# Altium schematic sheet LCD_Module.SchDoc
size A3
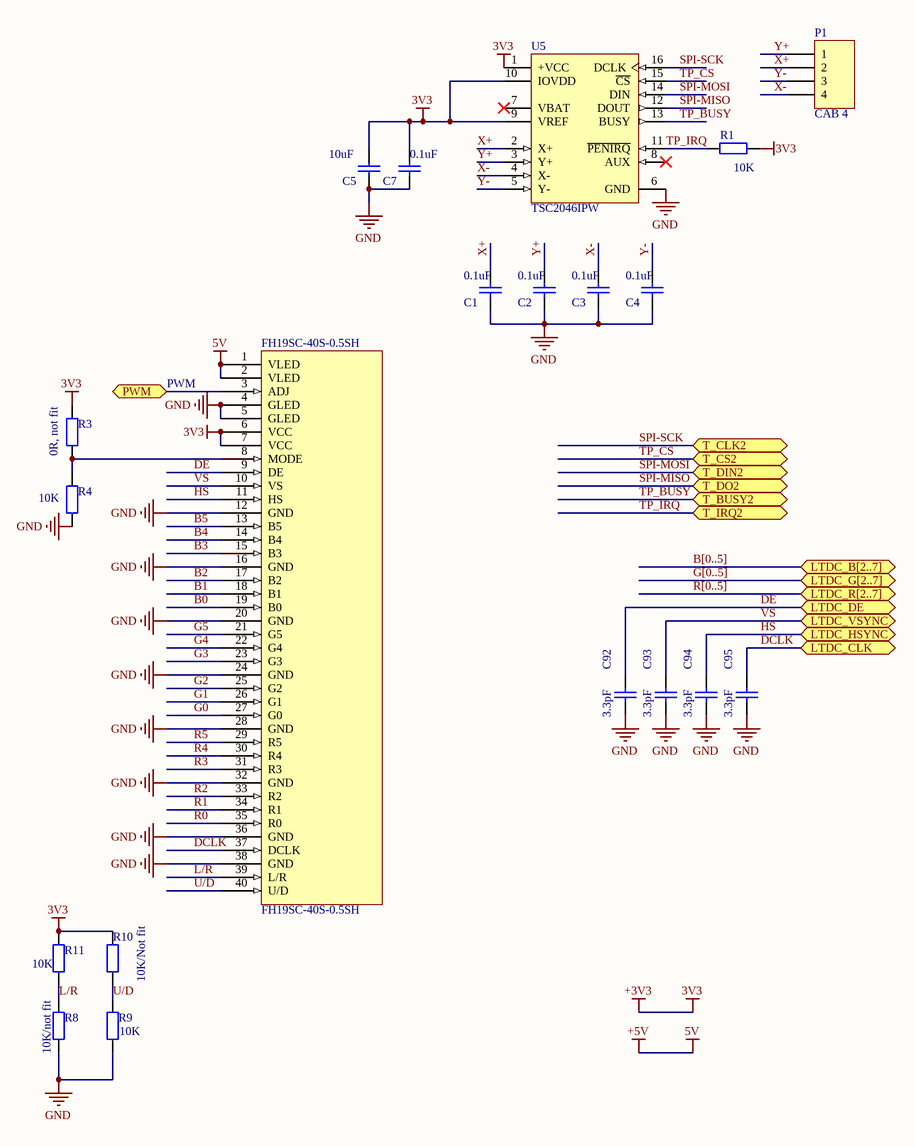
[diagram p0: LCD_Module.SchDoc]

## Parts
C1  0.1uF  [0603_C]
C2  0.1uF  [0603_C]
C3  0.1uF  [0603_C]
C4  0.1uF  [0603_C]
C5  10uF  [0603_C]
C7  0.1uF  [0603_C]
C92  3.3pF  [0603_C]
C93  3.3pF  [0603_C]
C94  3.3pF  [0603_C]
C95  3.3pF  [0603_C]
FH19SC-40S-0.5SH  FH19SC-40S-0.5SH  [FFC/SM0.5-2H40A]
P1  CAB 4  [FFC/SM1.0-2H4]
R1  10K  [0603_R]
R3  0R, not fit  [0603_R]
R4  10K  [0603_R]
R8  10K/not fit  [0603_R]
R9  10K  [0603_R]
R10  10K/Not fit  [0603_R]
R11  10K  [0603_R]
U5  TSC2046IPW  [PW016]

## Ports
LTDC_B[2..7], LTDC_CLK, LTDC_DE, LTDC_G[2..7], LTDC_HSYNC, LTDC_R[2..7], LTDC_VSYNC, PWM, T_BUSY2, T_CLK2, T_CS2, T_DIN2, T_DO2, T_IRQ2

## Nets
+3V3: C5.1 C7.1 FH19SC-40S-0.5SH.6(VCC) FH19SC-40S-0.5SH.7(VCC) R1.1 R3.2 R10.1 R11.1 U5.1(+VCC) U5.9(VREF) U5.10(IOVDD)  [also labelled 3V3]
+5V: FH19SC-40S-0.5SH.1(VLED) FH19SC-40S-0.5SH.2(VLED)  [also labelled 5V]
GND: C1.2 C2.2 C3.2 C4.2 C5.2 C7.2 C92.2 C93.2 C94.2 C95.2 FH19SC-40S-0.5SH.4(GLED) FH19SC-40S-0.5SH.5(GLED) FH19SC-40S-0.5SH.12(GND) FH19SC-40S-0.5SH.16(GND) FH19SC-40S-0.5SH.20(GND) FH19SC-40S-0.5SH.24(GND) FH19SC-40S-0.5SH.28(GND) FH19SC-40S-0.5SH.32(GND) FH19SC-40S-0.5SH.36(GND) FH19SC-40S-0.5SH.38(GND) R4.1 R8.2 R9.2 U5.6(GND)
B0: FH19SC-40S-0.5SH.19(B0)
B1: FH19SC-40S-0.5SH.18(B1)
B2: FH19SC-40S-0.5SH.17(B2)
B3: FH19SC-40S-0.5SH.15(B3)
B4: FH19SC-40S-0.5SH.14(B4)
B5: FH19SC-40S-0.5SH.13(B5)
DCLK: C95.1 FH19SC-40S-0.5SH.37(DCLK) ; port LTDC_CLK
DE: C92.1 FH19SC-40S-0.5SH.9(DE) ; port LTDC_DE
G0: FH19SC-40S-0.5SH.27(G0)
G1: FH19SC-40S-0.5SH.26(G1)
G2: FH19SC-40S-0.5SH.25(G2)
G3: FH19SC-40S-0.5SH.23(G3)
G4: FH19SC-40S-0.5SH.22(G4)
G5: FH19SC-40S-0.5SH.21(G5)
HS: C94.1 FH19SC-40S-0.5SH.11(HS) ; port LTDC_HSYNC
L/R: FH19SC-40S-0.5SH.39(L/R) R8.1 R11.2
PWM: FH19SC-40S-0.5SH.3(ADJ) ; port PWM
R0: FH19SC-40S-0.5SH.35(R0)
R1: FH19SC-40S-0.5SH.34(R1)
R2: FH19SC-40S-0.5SH.33(R2)
R3: FH19SC-40S-0.5SH.31(R3)
R4: FH19SC-40S-0.5SH.30(R4)
R5: FH19SC-40S-0.5SH.29(R5)
SPI-MISO: U5.12(DOUT) ; port T_DO2
SPI-MOSI: U5.14(DIN) ; port T_DIN2
SPI-SCK: U5.16(DCLK) ; port T_CLK2
TP_BUSY: U5.13(BUSY) ; port T_BUSY2
TP_CS: U5.15(~{CS}) ; port T_CS2
TP_IRQ: R1.2 U5.11(~{PENIRQ}) ; port T_IRQ2
U/D: FH19SC-40S-0.5SH.40(U/D) R9.1 R10.2
VS: C93.1 FH19SC-40S-0.5SH.10(VS) ; port LTDC_VSYNC
X+: C1.1 P1.2 U5.2(X+)
X-: C3.1 P1.4 U5.4(X-)
Y+: C2.1 P1.1 U5.3(Y+)
Y-: C4.1 P1.3 U5.5(Y-)
NetFH19SC-40S-0.5SH_8: FH19SC-40S-0.5SH.8(MODE) R3.1 R4.2

Not connected (* = marked no-connect by the designer): U5 7(VBAT)* 8(AUX)*

## Buses and harness runs
bus B[0..5] = port LTDC_B[2..7]
bus G[0..5] = port LTDC_G[2..7]
bus R[0..5] = port LTDC_R[2..7]

## Notes on the sheet
- PWM

## Library data of the parts
C1-C5 C7 = GRM188R71A225KE15: Murata General Purpose Ceramic Cap 0603 2.2uF 10V 10% X7R; Supplier 1: Digi-Key; Supplier Part Number 1: 490-4520-1-ND
  C1-C4 C7: Value: 0.1uF
  C5: Value: 10uF
C92-C95 = GRM188R71A225KE15: Murata General Purpose Ceramic Cap 0603 2.2uF 10V 10% X7R; Value: 10nF; Supplier 1: Digi-Key; Supplier Part Number 1: 490-4520-1-ND
P1 = Header 4: Header, 4-Pin; LatestRevisionDate: 17-Jul-2002; LatestRevisionNote: Re-released for DXP Platform.; Publisher: Altium Limited
R1 R3 R4 R8-R11 = RC0603JR-0710RL: Yageo RES 10R 5% 1/10W 0603; Supplier 1: Digi-Key; Supplier Part Number 1: 311-10GRCT-ND
  R1 R4 R9 R11: Value: 10K
  R3: Value: 0R, not fit
  R8: Value: 10K/not fit
  R10: Value: 10K/Not fit
U5 = TSC2046IPW: 4-Wire Touch Screen controller with Low-Voltage I/O Interface, 16-Pin TSSOP, Pb-Free; Published: 6-Oct-2005; DatasheetVersion: Jan-2005; PackageVersion: Feb-1999; PackageReference: PW016; Publisher: Altium Limited; PackageDescription: Shrink Small Outline; 16 Leads; Body Width 4.4 mm; Pitch 0.65 mm; ComponentLink1Description: Manufacturer Link; ComponentLink1URL: http://focus.ti.com/docs/prod/folders/print/tsc2046.html; ComponentLink2Description: Datasheet; ComponentLink2URL: http://focus.ti.com/lit/ds/symlink/tcs2046.pdf